# EasyEDA Pro project ProPrj_acoustic imager test_2026-03-05.epro

# Schematic Schematic1
Board Name: Board1; Create Date: 2026-03-05; Page Name: P1; Project Name: acoustic imager test; Schematic Name: Schematic1; Update Date: 2026-03-05; Company: EasyEDA.com; Page Size: A4; Version: V1.0
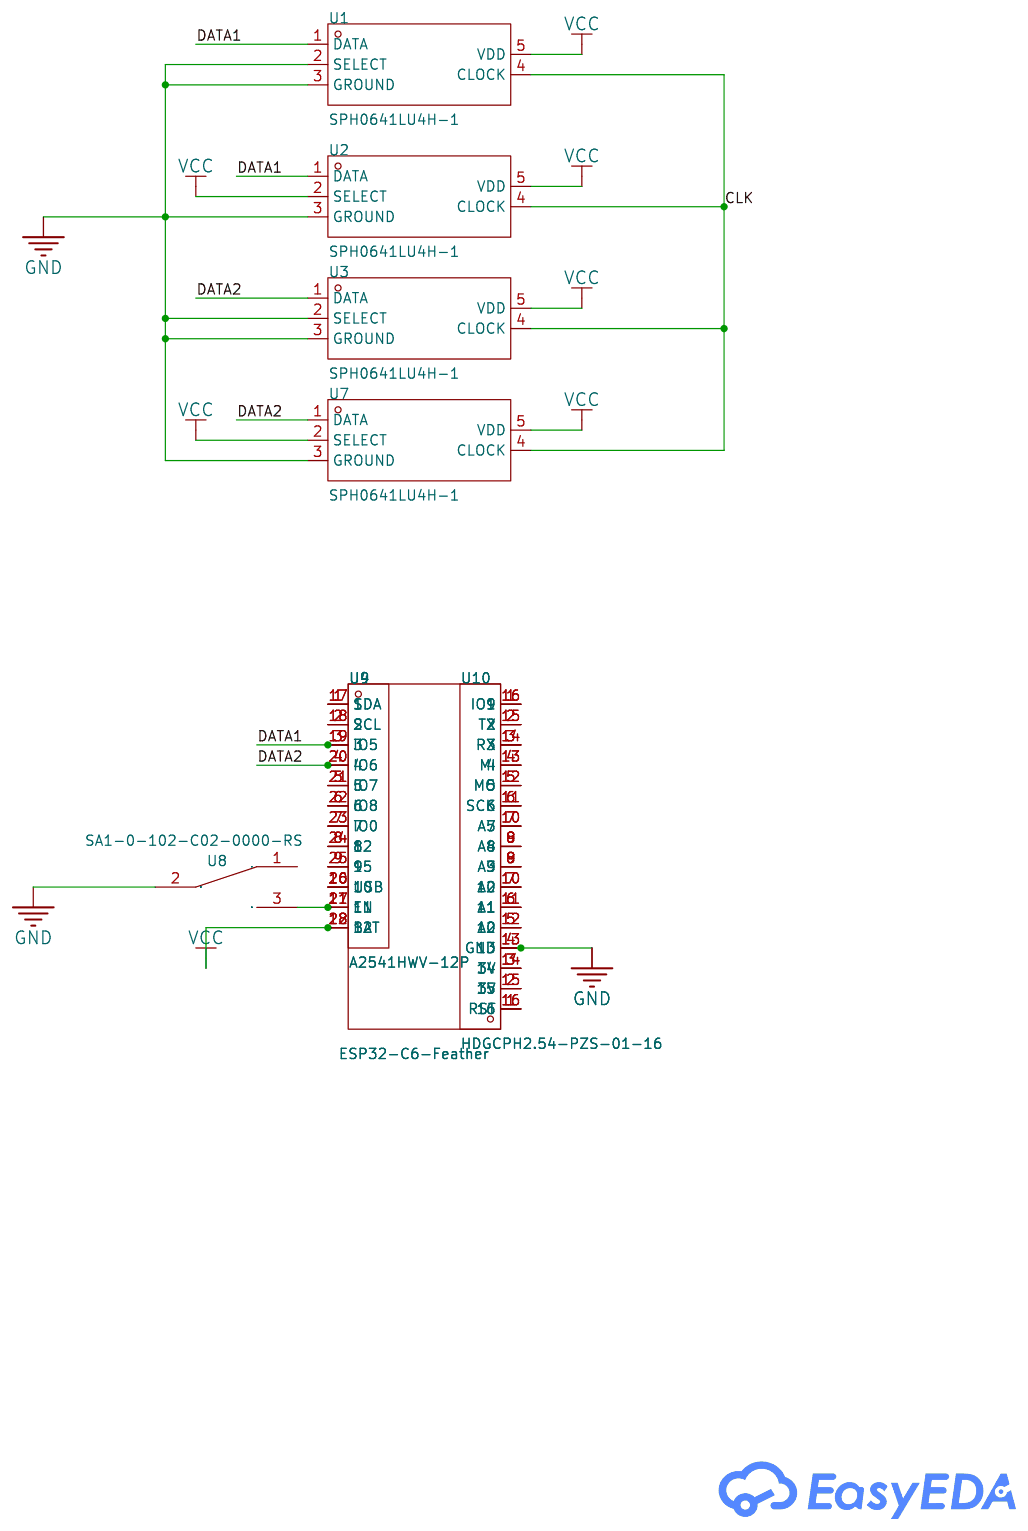
[diagram p0: schematic sheet]

## Parts
U1  SPH0641LU4H-1  [MIC-SMD_5P_L3.5-W2.7-P0.82_SPH0641LU4H-1]
U2  SPH0641LU4H-1  [MIC-SMD_5P_L3.5-W2.7-P0.82_SPH0641LU4H-1]
U3  SPH0641LU4H-1  [MIC-SMD_5P_L3.5-W2.7-P0.82_SPH0641LU4H-1]
U4  ESP32-C6-Feather  [COMM-TH_L50.8-W22.9-P2.54-LS20.32]
U7  SPH0641LU4H-1  [MIC-SMD_5P_L3.5-W2.7-P0.82_SPH0641LU4H-1]
U8  SA1-0-102-C02-0000-RS  [SW-TH_SA1-0-102-C02-0000-RS]
U9  A2541HWV-12P  [HDR-TH_12P-P2.54-V-F-1]
U10  HDGCPH2.54-PZS-01-16  [HDR-TH_16P-P2.54_HDGCPH2.54-PZS-01-16]

## Library data of the parts
U1-U3 U7 = SPH0641LU4H-1: Direction:Omnidirectional Voltage - Supply:1.8V Voltage - Supply:1.8V Current Consumption:235uA~270uA Current Consumption:235uA~270uA S/N Ratio:64.3dB Sensitivity:-26dB Sensitivity:-26dB Length:3.5mm Width:2.65mm Height:0.98mm; LCSC Part Name: 1.8V -26dB; Supplier Part: C2879853; Manufacturer: Knowles(楼氏); JLCPCB Part Class: Extended Part; Datasheet: https://item.szlcsc.com/datasheet/SPH0641LU4H-1/3089079.html; Supplier: LCSC; Direction: Omnidirectional; Voltage - Supply: 1.8V; Current Consumption: 235uA~270uA; S/N Ratio: 64.3dB; Sensitivity: -26dB; Length: 3.5mm; Width: 2.65mm; Height: 0.98mm
U4 = ESP32-C6-Feather: Supplier Part: C9900163338; Supplier Footprint: 插件; Supplier: LCSC
U8 = SA1-0-102-C02-0000-RS: LCSC Part Name: 超小型钮子开关 3脚2档 防水全塑胶; Supplier Part: C22449121; Manufacturer: YUEN FUNG(源丰); Supplier Footprint: 插件-3P,8.1x5.9mm; JLCPCB Part Class: Extended Part; Datasheet: https://atta.szlcsc.com/upload/public/pdf/source/20240530/DFC727F3C9E3BD30CF712B124CBCA431.pdf; Supplier: LCSC
U9 = A2541HWV-12P_C5333411: Holes Structure:1x12P Pitch:2.54mm Row Spacing:- Circular Hole / Square Hole:方孔 Mounting Type:Straight Number of Rows:Plugin Number of Holes:12P Current Rating (Max):3A Voltage Rating (Max):250V Holes Direction:Top Insulation Height:8.5mm Contact Material; LCSC Part Name: 1x12P 间距:2.54mm 直插; Supplier Part: C5333411; Manufacturer: CJT(长江连接器); Supplier Footprint: 插件,P=2.54mm; JLCPCB Part Class: Extended Part; Datasheet: https://atta.szlcsc.com/upload/public/pdf/source/20190522/C339348_148DC62DFEE35B66DE27661541078F4A.pdf; Supplier: LCSC; Holes Structure: 1x12P; Pitch: 2.54mm; Circular Hole / Square Hole: 方孔; Mounting Type: Straight; Number of Rows: Plugin; Number of Holes: 12P; Current Rating (Max): 3A; Voltage Rating (Max): 250V; Holes Direction: Top; Insulation Height: 8.5mm; Contact Material: Brass; Contact Plating: Gold; Operating Temperature Range: -40℃~+105℃; PIN Length: 3.2mm
U10 = HDGCPH2.54-PZS-01-16: Holes Structure:1x16P Pitch:2.54mm Circular Hole / Square Hole:Square Hole Mounting Type:Through Hole Number of Rows:1 Number of Positions:16P Current Rating:3A Holes Direction:Top Insulation Height:8.5mm Contact Material:Brass Operating Temperature:-40℃~; LCSC Part Name: 1x16P 间距:2.54mm 直插; Supplier Part: C19725273; Manufacturer: HDGC(华德共创); Supplier Footprint: 插件,P=2.54mm; JLCPCB Part Class: Extended Part; Datasheet: https://item.szlcsc.com/datasheet/HDGCPH2.54-PZS-01-16/21047370.html; Supplier: LCSC; Holes Structure: 1x16P; Pitch: 2.54mm; Circular Hole / Square Hole: Square Hole; Mounting Type: Through Hole; Number of Rows: 1; Number of Positions: 16P; Current Rating: 3A; Holes Direction: Top; Insulation Height: 8.5mm; Contact Material: Brass; Operating Temperature: -40℃~+105℃; PIN Length: 3mm

## Nets
GND: U1.2(SELECT) U1.3(GROUND) U2.3(GROUND) U3.2(SELECT) U3.3(GROUND) U4.4(GND) U7.3(GROUND) U8.2 U10.13
VCC: U1.5(VDD) U2.2(SELECT) U2.5(VDD) U3.5(VDD) U4.28(BAT) U7.2(SELECT) U7.5(VDD) U9.12
CLK: U1.4(CLOCK) U2.4(CLOCK) U3.4(CLOCK) U7.4(CLOCK)
DATA1: U1.1(DATA) U2.1(DATA) U4.19(IO5) U9.3
DATA2: U3.1(DATA) U4.20(IO6) U7.1(DATA) U9.4
Net-(U4-1): U4.1(RST) U10.16
Net-(U4-2): U4.2(3V) U10.15
Net-(U4-3): U4.3(3V) U10.14
Net-(U4-5): U4.5(A0) U10.12
Net-(U4-6): U4.6(A1) U10.11
Net-(U4-7): U4.7(A2) U10.10
Net-(U4-8): U4.8(A3) U10.9
Net-(U4-9): U4.9(A4) U10.8
Net-(U4-10): U4.10(A5) U10.7
Net-(U4-11): U4.11(SCK) U10.6
Net-(U4-12): U4.12(MO) U10.5
Net-(U4-13): U4.13(MI) U10.4
Net-(U4-14): U4.14(RX) U10.3
Net-(U4-15): U4.15(TX) U10.2
Net-(U4-16): U4.16(IO9) U10.1
Net-(U4-17): U4.17(SDA) U9.1
Net-(U4-18): U4.18(SCL) U9.2
Net-(U4-21): U4.21(IO7) U9.5
Net-(U4-22): U4.22(IO8) U9.6
Net-(U4-23): U4.23(IO0) U9.7
Net-(U4-24): U4.24(12) U9.8
Net-(U4-25): U4.25(15) U9.9
Net-(U4-26): U4.26(USB) U9.10
Net-(U4-27): U4.27(EN) U8.3 U9.11

Not connected (* = marked no-connect by the designer): U8 1

# Board PCB1
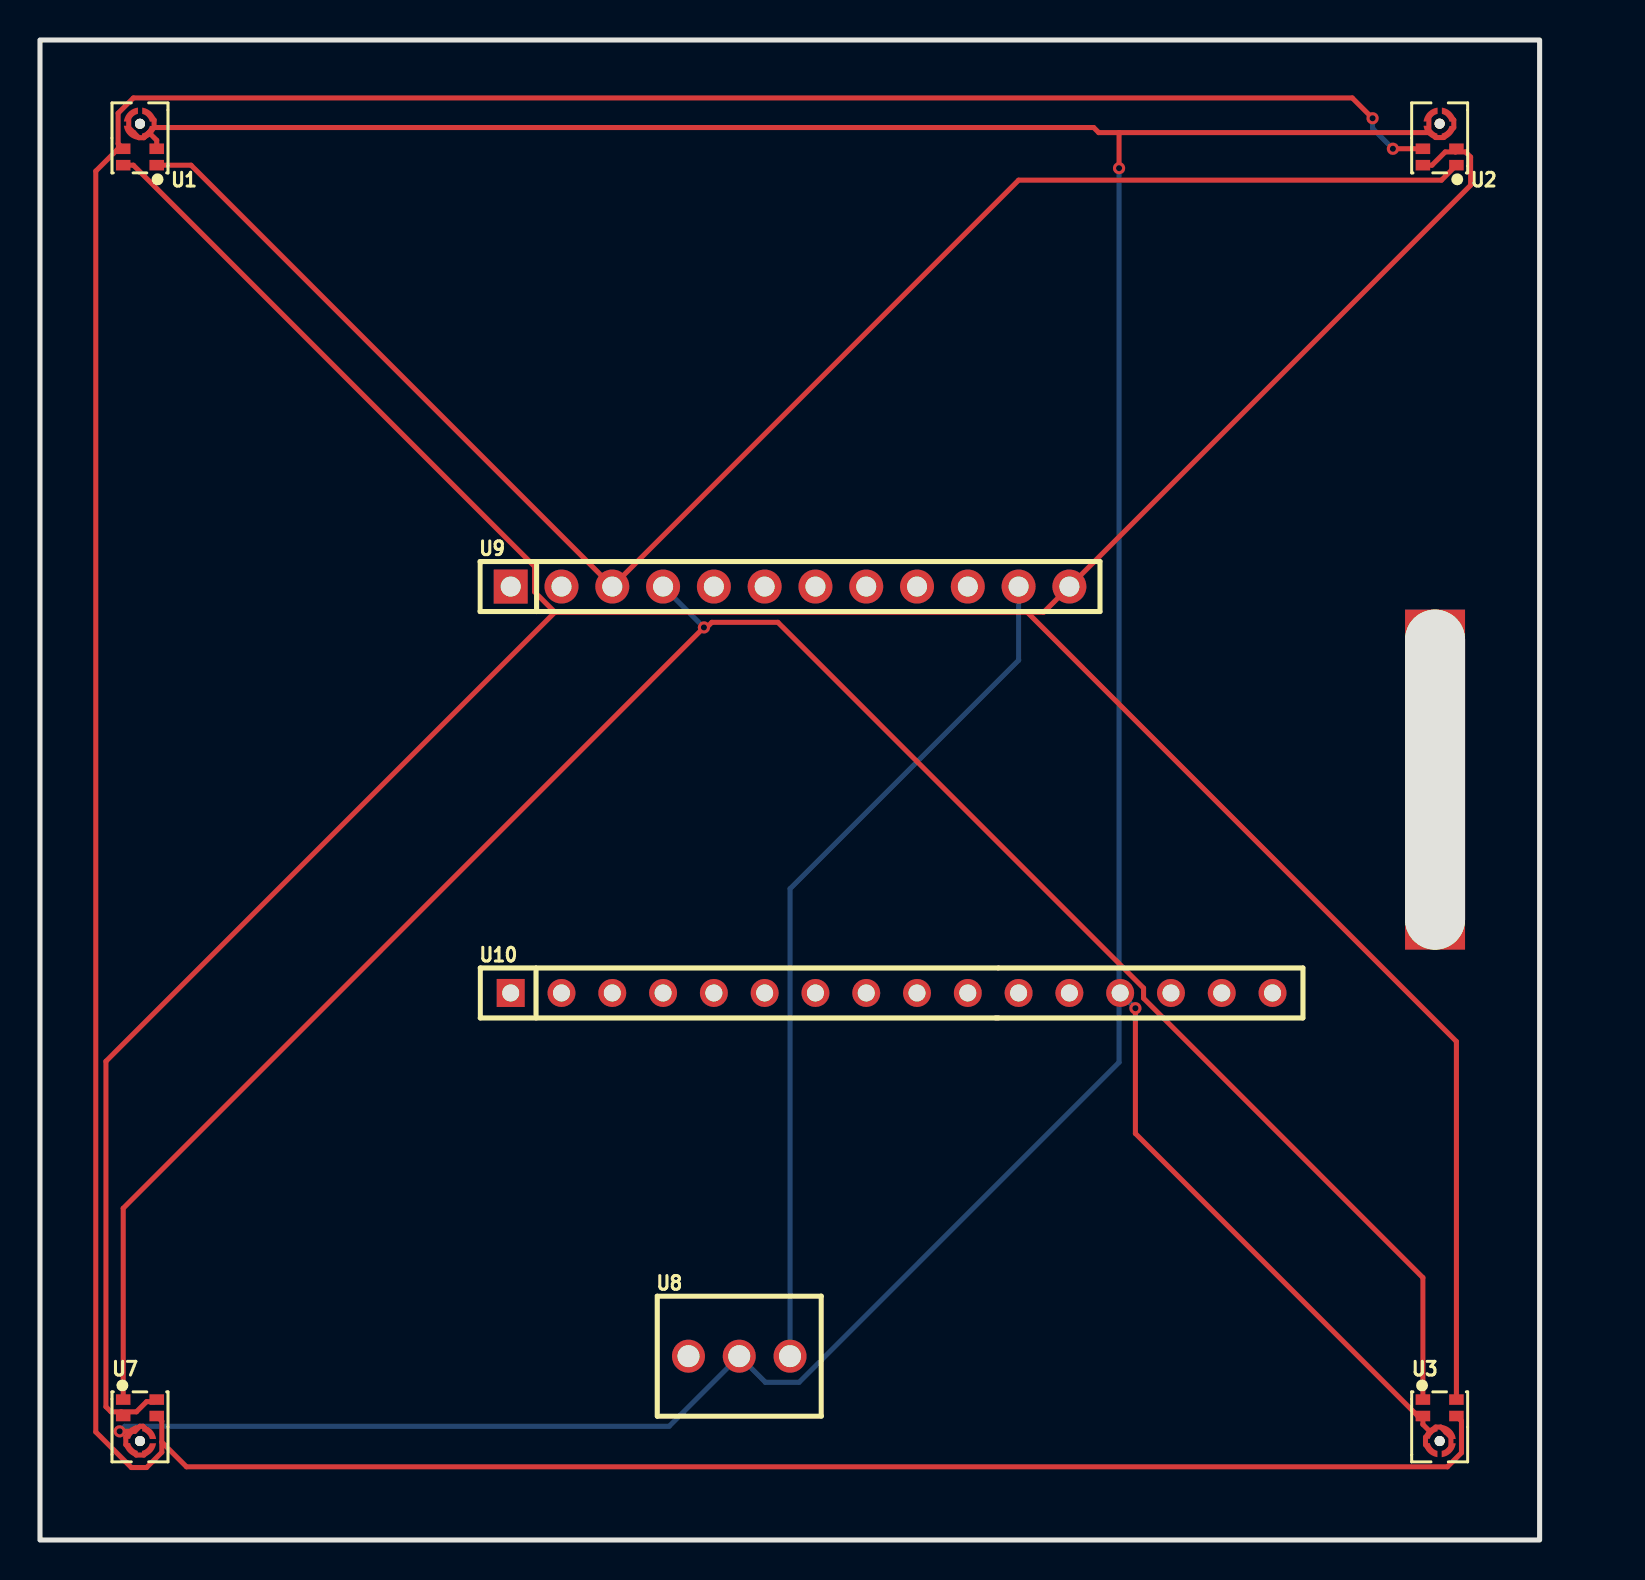
[diagram p1: board, top side]
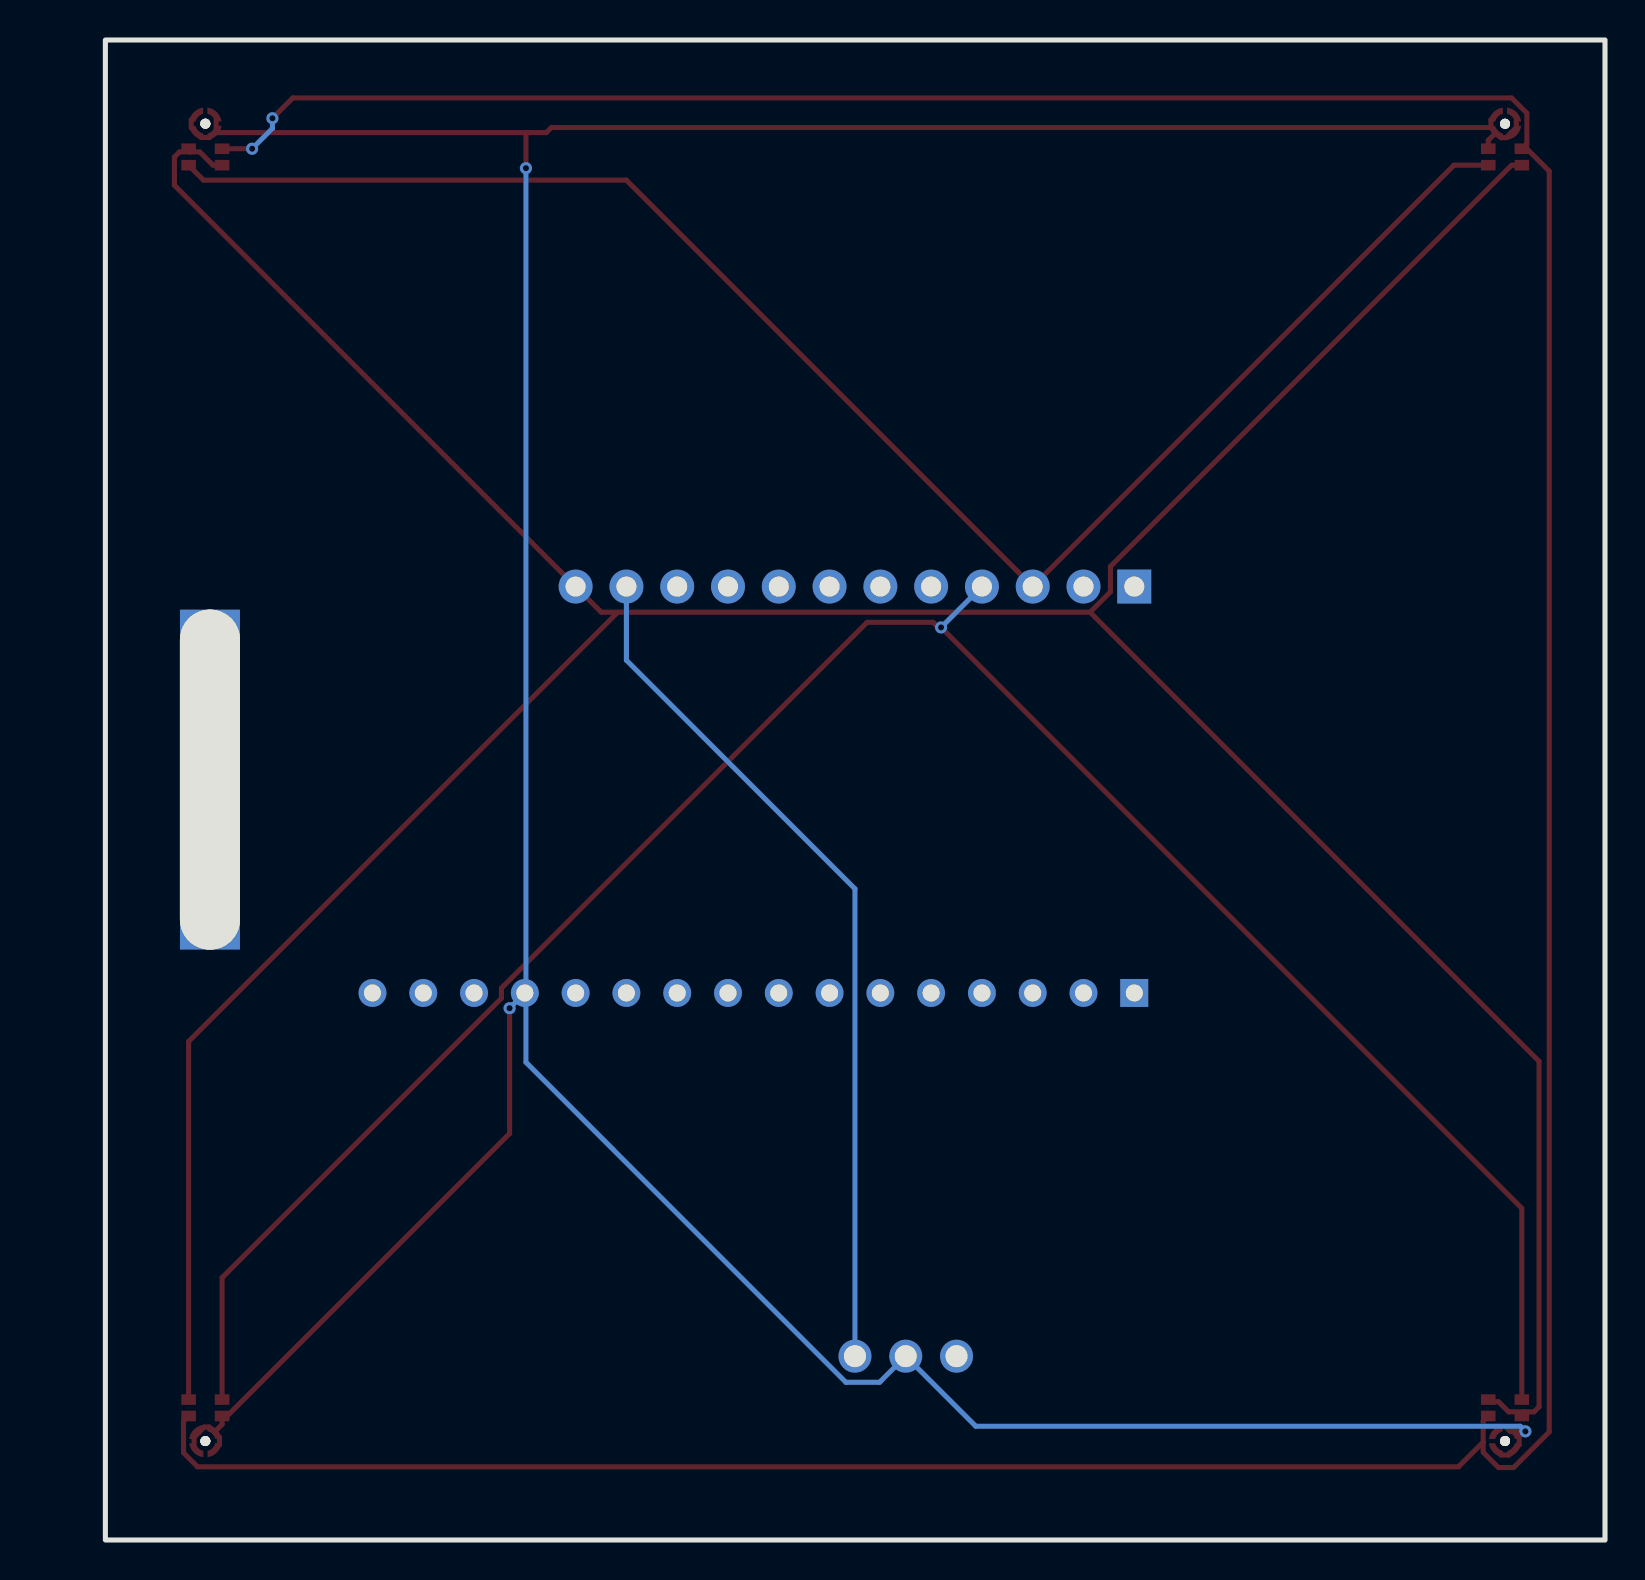
[diagram p2: board, bottom side, seen from below]

Outline 75 x 75 mm; copper layers: Top Layer, Bottom Layer. Coordinates in mm from the lower left corner of the outline.
Outline path: rectangle 0,75 75,0
Stack: Top Layer 0.035mm / Dielectric1 1.51mm FR4 er 4.5 / Bottom Layer 0.035mm

## Design rules (mm)
net DATA1: DP1
net DATA2: DP1
template: JLCPCB Capability(Two Layers Board)
spacing copperThickness1oz (default): track to track 0.102, other pairs 0.152 to 0.3
spacing copperThickness2oz: track to track 0.203, other pairs 0.152 to 0.3
track width copperThickness1oz (default): min 0.127, default 0.254, max 2.54
track width copperThickness2oz: min 0.203, default 0.254, max 2.54
differential pair differentialPair (default): width min 0.127, default 0.254, max 2.54; gap min 0.152, default 0.152
via viaSize (default): diameter min 0.5, default 0.61, max 10; hole min 0.3, default 0.305, max 6.3

## Placement (name value [footprint] x y rotation side)
NOREF  -  [Pad_e1948]  5 4.95 0 top
NOREF#2  -  [Pad_e1944]  70 70.81 0 top
NOREF#3  -  [Pad_e1942]  5 70.81 0 top
NOREF#4  -  [Pad_e2267]  69.77 38.02 0 top
NOREF#5  -  [Pad_e1946]  70 4.95 0 top
U1  SPH0641LU4H-1  [MIC-SMD_5P_L3.5-W2.7-P0.82_SPH0641LU4H-1]  5 70 180 top
U2  SPH0641LU4H-1  [MIC-SMD_5P_L3.5-W2.7-P0.82_SPH0641LU4H-1]  70 70 180 top
U3  SPH0641LU4H-1  [MIC-SMD_5P_L3.5-W2.7-P0.82_SPH0641LU4H-1]  70 5.76 0 top
U7  SPH0641LU4H-1  [MIC-SMD_5P_L3.5-W2.7-P0.82_SPH0641LU4H-1]  5 5.76 0 top
U8  SA1-0-102-C02-0000-RS  [SW-TH_SA1-0-102-C02-0000-RS]  34.97 9.19 0 top
U9  A2541HWV-12P  [HDR-TH_12P-P2.54-V-F-1]  37.51 47.67 0 top
U10  HDGCPH2.54-PZS-01-16  [HDR-TH_16P-P2.54_HDGCPH2.54-PZS-01-16]  42.59 27.35 0 top

## Footprints (pads in the part's own frame, mm; a bottom-side part is the same pattern mirrored in y, then rotated)
HDR-TH_12P-P2.54-V-F-1
  rect 1.7x1.7 hole 1: 1(-13.97,0)
  round 1.7 hole 1: 2(-11.43,0) 3(-8.89,0) 4(-6.35,0) 5(-3.81,0) 6(-1.27,0) 7(1.27,0) 8(3.81,0) 9(6.35,0) 10(8.89,0) 11(11.43,0) 12(13.97,0)
HDR-TH_16P-P2.54_HDGCPH2.54-PZS-01-16
  rect 1.4x1.4 hole 0.85: 1(-19.05,0)
  round 1.4 hole 0.85: 2(-16.51,0) 3(-13.97,0) 4(-11.43,0) 5(-8.89,0) 6(-6.35,0) 7(-3.81,0) 8(-1.27,0) 9(1.27,0) 10(3.81,0) 11(6.35,0) 12(8.89,0) 13(11.43,0) 14(13.97,0) 15(16.51,0) 16(19.05,0)
MIC-SMD_5P_L3.5-W2.7-P0.82_SPH0641LU4H-1
  rect 0.73x0.53 smd: 1(-0.838,1.26) 2(-0.838,0.438) 4(0.838,0.438) 5(0.838,1.26)
  custom 0.696x0.705 smd: 3(-0.459,-1.25) 3(0.459,-0.379)
  custom 0.704x0.696 smd: 3(-0.453,-0.369) 3(0.453,-1.26)
Pad_e1942
  round 0.5 hole 12x0.5: 1(0,0)
Pad_e1944
  round 0.5 hole 0.5: 1(0,0)
Pad_e1946
  round 0.5 hole 0.5: 1(0,0)
Pad_e1948
  round 0.5 hole 0.5: 1(0,0)
Pad_e2267
  rect 3x17 hole 3x17: 1(0,0)
SW-TH_SA1-0-102-C02-0000-RS
  round 1.65 hole 1.1: 1(-2.54,0) 2(0,0) 3(2.54,0)

## Nets
As in the schematic, except:
$1N1201: U8.3 U9.11

Pads without a net: NOREF 1; NOREF#2 1; NOREF#3 1; NOREF#4 1; NOREF#5 1; U8 1

## Via types
v1: diameter 0.61, hole 0.305, Top Layer to Bottom Layer, 6 vias

## Routing (per net, layer and track width the routed paths; a pad name or vN(x,y) marks a point on that pad's centre or on a via; arc(x,y) is an arc through that point)
GND: length 212.4
  Top Layer w0.254: 53.97,70.37 69.46,70.37 ; 53.97,70.37 52.95,70.37 52.7,70.62 5.71,70.62 ; 53.97,70.37 v1(53.97,68.59) ; 69.46,70.37 69.46,71.17 U2.3 ; 69.46,70.37 U2.3 69.8,70.12 70.21,70.12 U2.3 70.71,70.62 70.71,71 U2.3 ; U3.3 70.56,4.61 70.56,5.14 70.31,5.39 ; 5.71,70.62 5.71,71 U1.3 ; 5.71,70.62 U1.3 ; 70.31,5.39 U3.3 ; 70.31,5.39 70.06,5.65 69.8,5.65 U3.3 ; U1.2 5.84,69.98 U1.3 ; U1.3 5.2,70.11 4.94,70.11 4.69,70.37 ; 4.49,5.43 U7.3 4.29,5.14 4.29,4.76 U7.3 4.81,4.25 5.2,4.25 U7.3 ; 4.49,5.43 v1(3.98,5.43) ; 4.49,5.43 4.75,5.43 5,5.69 5.16,5.69 U7.3 ; 4.69,70.37 U1.3 ; 4.69,70.37 4.44,70.62 4.44,71.15 U1.3 ; U3.3 69.29,5.14 69.29,4.76 U3.3 ; U3.3 69.16,5.78 U3.2 68.91,6.2 54.78,20.32 v1(54.78,26.59)
  Bottom Layer w0.254: 53.97,27.44 53.97,23.89 37.97,7.88 36.28,7.88 U8.2 31.47,5.69 4.24,5.69 v1(3.98,5.43) ; 53.97,27.44 v1(53.97,68.59) ; 53.97,27.44 U10.13 v1(54.78,26.59)
VCC: length 191
  Top Layer w0.254: 70.79,69.4 U2.2 ; 70.79,69.4 70.28,69.4 69.62,68.74 U2.5 ; 70.79,69.4 71.29,69.4 71.55,69.15 71.55,67.74 U9.12 50.2,46.39 49.37,46.39 ; 4.06,6.41 4.06,6.3 U7.2 ; 4.06,6.41 3.55,6.41 3.3,6.66 3.3,23.93 25.75,46.39 ; 4.06,6.41 4.82,6.41 5.33,6.92 5.73,6.92 U7.5 ; 25.75,46.39 24.74,47.4 24.74,48.67 4.67,68.74 U1.5 ; 25.75,46.39 49.37,46.39 ; U3.5 70.84,24.92 49.37,46.39
CLK: length 207.7
  Top Layer w0.254: 6.09,4.89 6.09,5.95 U7.4 ; 6.09,4.89 7.33,3.66 70.39,3.66 71.09,4.36 71.09,5.95 U3.4 ; 6.09,4.89 6.09,4.39 5.33,3.62 4.57,3.62 2.79,5.4 2.79,68.44 3.91,69.56 U1.4 3.91,69.82 3.91,71.34 4.67,72.1 65.63,72.1 v1(66.65,71.09) ; v1(67.66,69.56) U2.4
  Bottom Layer w0.254: v1(66.65,71.09) 66.65,70.58 v1(67.66,69.56)
DATA1: length 82.5
  Top Layer w0.254: U1.1 7.55,68.74 U9.3 48.94,67.99 70.09,67.99 U2.1
DATA2: length 109.6
  Top Layer w0.254: U3.1 69.16,13.12 55.19,27.09 55.19,27.6 36.9,45.88 33.6,45.88 33.35,45.63 v1(33.2,45.63) 4.16,16.59 U7.1
  Bottom Layer w0.254: v1(33.2,45.63) U9.4
$1N1201: length 43.2
  Bottom Layer w0.254: U8.3 37.51,32.56 48.94,43.99 U9.11
